# EAGLE schematic WSM (EAGLE 6.4)
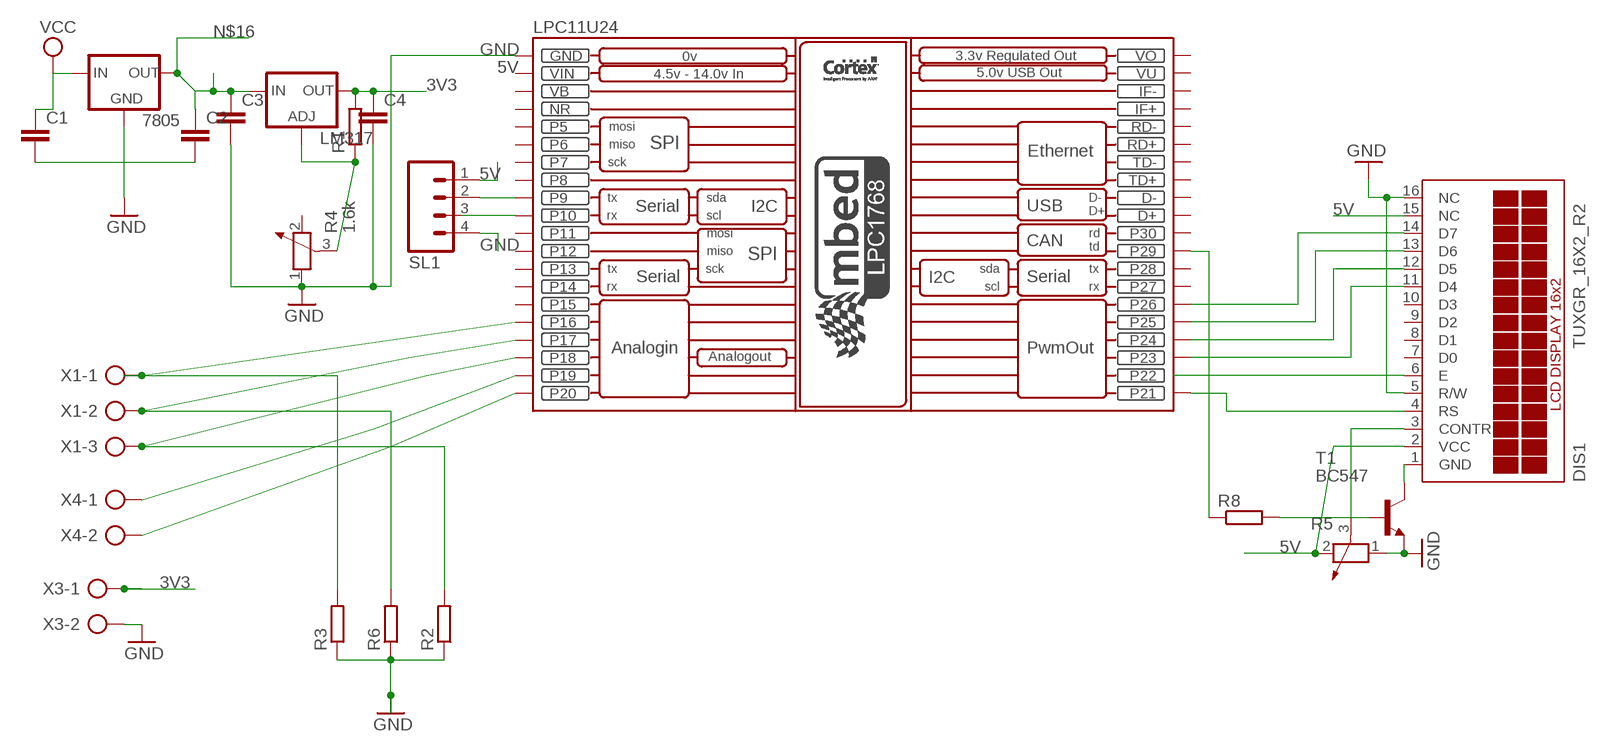
[diagram p0: schematic, sheet 1]

## Parts
7805  78XXL  [78XXL]
C1  C-EU150-084X183  [C150-084X183]
C2  C-EU150-084X183  [C150-084X183]
C3  C-EU150-084X183  [C150-084X183]
C4  C-EU150-084X183  [C150-084X183]
DIS1  TUXGR_16X2_R2  [TUXGR_16X2_R2]
LM317  LM317TL  [317TL]
LPC11U24  MBED_NXP_LPC1768  [MBED-KIT]
R1  R-EU_0817/22  [P0817/22]
R2  R-EU_0817/22  [P0817/22]
R3  R-EU_0817/22  [P0817/22]
R4  1.6k  POTENTIOMETER_PT-10  [PT-10]
R5  POTENTIOMETER_PT-10  [PT-10]
R6  R-EU_0817/22  [P0817/22]
R8  R-EU_0817/22  [P0817/22]
SL1  M04  [04P]
T1  BC547  [TO92]
X1  AK300/3  [AK300/3]
X3  AK300/2  [AK300/2]
X4  AK300/2  [AK300/2]

## Nets
3V3: C4.1 LM317.2(OUT) R1.2 X3.1
5V: DIS1.2(VCC) DIS1.15(NC) R5.2 SL1.1
GND: 7805.GND C1.2 C2.2 C3.2 C4.2 DIS1.5(R/W) DIS1.16(NC) LPC11U24.GND R2.1 R3.1 R4.1 R5.1 R6.1 SL1.4 T1.1(E) X3.2
GSM: LPC11U24.P$10(P10)
N$1: DIS1.1(GND) T1.3(C)
N$2: LM317.1(ADJ) R1.1 R4.3
N$3: LPC11U24.P$16(P16) R3.2 X1.1
N$4: DIS1.3(CONTR) R5.3
N$5: DIS1.4(RS) LPC11U24.P$21(P21)
N$6: DIS1.6(E)
N$7: DIS1.11(D4) LPC11U24.P$23(P23)
N$8: DIS1.12(D5) LPC11U24.P$24(P24)
N$9: DIS1.13(D6) LPC11U24.P$25(P25)
N$10: DIS1.14(D7) LPC11U24.P$26(P26)
N$11: LPC11U24.P$17(P17) R6.2 X1.2
N$12: LPC11U24.P$9(P9) SL1.2
N$13: LPC11U24.P$18(P18) R2.2 X1.3
N$14: LPC11U24.P$19(P19) X4.1
N$15: LPC11U24.P$20(P20) X4.2
N$16: 7805.OUT C2.1 C3.1 LM317.3(IN)
N$17: R8.2 T1.2(B)
N$18: LPC11U24.P$29(P29) R8.1
VCC: 7805.IN C1.1
Unconnected: DIS1.7(D0) DIS1.8(D1) DIS1.9(D2) DIS1.10(D3) LPC11U24.D+ LPC11U24.D- LPC11U24.IF+ LPC11U24.IF- LPC11U24.P$5(P5) LPC11U24.P$6(P6) LPC11U24.P$7(P7) LPC11U24.P$8(P8) LPC11U24.P$11(P11) LPC11U24.P$12(P12) LPC11U24.P$13(P13) LPC11U24.P$14(P14) LPC11U24.P$15(P15) LPC11U24.P$22(P22) LPC11U24.P$27(P27) LPC11U24.P$28(P28) LPC11U24.P$30(P30) LPC11U24.RD+ LPC11U24.RD- LPC11U24.TD+ LPC11U24.TD- R4.2 SL1.3

## Power pins joined to a net without a drawn wire
NR: LPC11U24.NR
VB: LPC11U24.VB
VIN: LPC11U24.VIN
VO: LPC11U24.VOUT(VO)
VU: LPC11U24.VU

## Library data of the parts
7805 = v-reg:78XXL: VOLTAGE REGULATOR
C1-C4 = resistor:C-EU: CAPACITOR, European symbol
DIS1 = display-lcd:TUXGR_16X2_R2: Tuxgraphics LCD display 16x2 characters reflective, without background light Source: tuxgr_12x2_r2.pdf; OC_FARNELL: unknown; OC_NEWARK: unknown
LM317 = v-reg:LM317TL: VOLTAGE REGULATOR
LPC11U24 = MBED_v2.1:MBED_NXP_LPC1768: Mbed LPC1768 - ARM CORTEX v2.1 * Schematic symbol is now placed in eagles's default raster. *The pads diameter are suitable for routing between mbed pins * mbed pads are 0.8 mm drill diameter. --------------------------------------------- Created by: Mohamed Yousry *Alexandria, Egypt *Email: mohamed.yousry@ieeegoldegypt.org
R1-R3 R6 R8 = rcl:R-EU_: RESISTOR, European symbol
R4 R5 = rcl:POTENTIOMETER_: Potentiometer
SL1 = con-amp-quick:M04: AMP QUICK CONNECTOR; OC_FARNELL: unknown; OC_NEWARK: unknown
T1 = transistor:BC547: NPN TRANSISTOR
X1 = con-ptr500:AK300/3: CONNECTOR; OC_FARNELL: unknown; OC_NEWARK: unknown
X3 X4 = con-ptr500:AK300/2: CONNECTOR; OC_FARNELL: unknown; OC_NEWARK: unknown